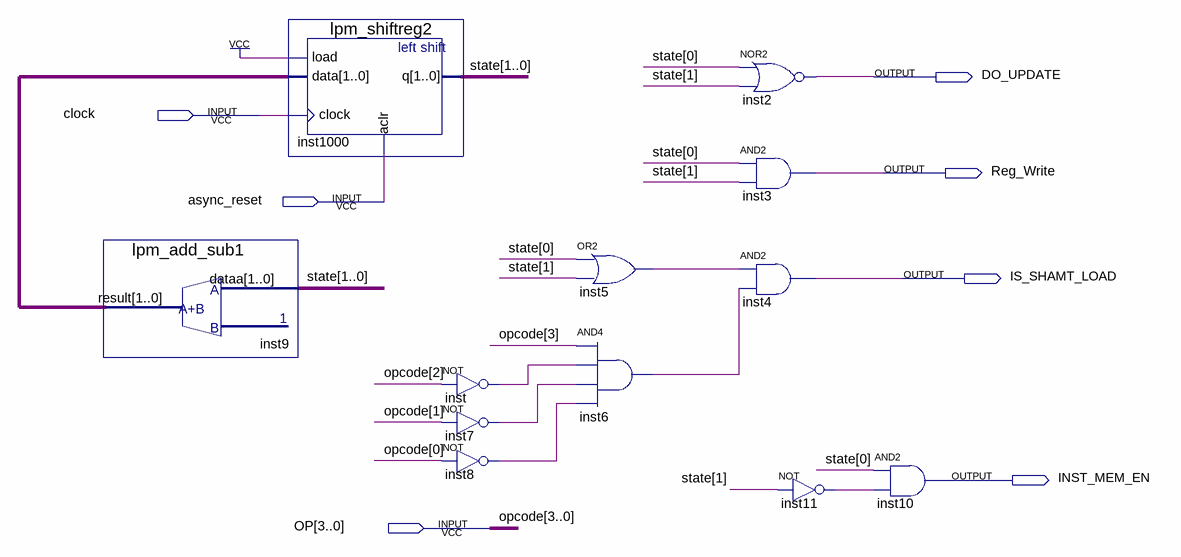
[diagram p0: schematic sheet]
// Quartus schematic CU.bdf as structural Verilog: 12 symbols, 7 pins
module CU (
  input  clock,
  input  async_reset,
  input  [3:0] OP,
  output DO_UPDATE,
  output Reg_Write,
  output IS_SHAMT_LOAD,
  output INST_MEM_EN
);

  wire inst5_out, inst6_out, inst7_out, inst8_out, inst11_out, inst_out;
  wire [1:0] inst9_result, state;

  lpm_add_sub1 inst9 (.dataa(state), .result(inst9_result));
  lpm_shiftreg2 inst1000 (.load(1'b1), .data(inst9_result), .clock(clock), .aclr(async_reset), .q(state));
  not inst (inst_out, OP[2]);
  not inst7 (inst7_out, OP[1]);
  not inst8 (inst8_out, OP[0]);
  or inst5 (inst5_out, state[0], state[1]);
  and inst6 (inst6_out, OP[3], inst_out, inst7_out, inst8_out);
  nor inst2 (DO_UPDATE, state[0], state[1]);
  and inst3 (Reg_Write, state[0], state[1]);
  and inst4 (IS_SHAMT_LOAD, inst5_out, inst6_out);
  not inst11 (inst11_out, state[1]);
  and inst10 (INST_MEM_EN, state[0], inst11_out);

  // Other names for the same wires on the sheet: opcode[3:0] = OP
endmodule
